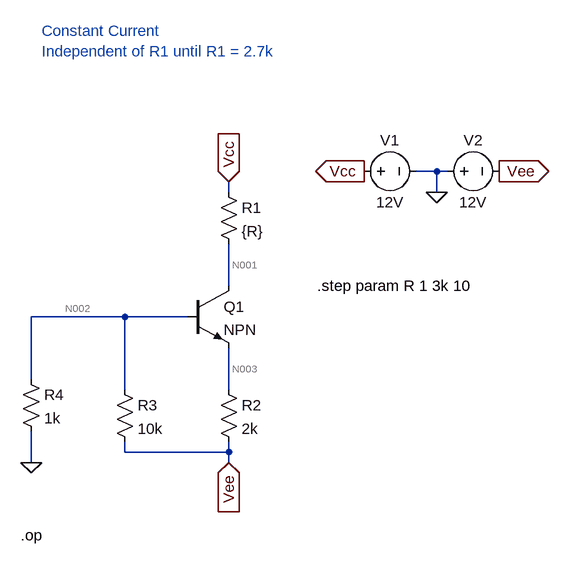
[diagram p0: schematic constant_current.asc]
constant_current.asc, the LTspice schematic file:
Version 4.1
SHEET 1 880 680
WIRE 608 -32 576 -32
WIRE 624 -32 608 -32
WIRE 288 0 288 -16
WIRE 608 0 608 -32
WIRE 288 144 288 80
WIRE 128 192 -16 192
WIRE 224 192 128 192
WIRE -16 288 -16 192
WIRE 128 304 128 192
WIRE 288 304 288 240
WIRE 128 400 128 384
WIRE 288 400 288 384
WIRE 288 400 128 400
WIRE -16 416 -16 368
WIRE 288 416 288 400
FLAG 608 0 0
FLAG 496 -32 Vcc
IOPIN 496 -32 Out
FLAG 704 -32 Vee
IOPIN 704 -32 Out
FLAG 288 -16 Vcc
IOPIN 288 -16 In
FLAG 288 416 Vee
IOPIN 288 416 In
FLAG -16 416 0
SYMBOL npn 224 144 R0
SYMATTR InstName Q1
SYMBOL voltage 480 -32 R270
WINDOW 0 32 56 VTop 2
WINDOW 3 -32 56 VBottom 2
WINDOW 123 0 0 Left 0
WINDOW 39 0 0 Left 0
SYMATTR InstName V1
SYMATTR Value 12V
SYMBOL res 272 -16 R0
SYMATTR InstName R1
SYMATTR Value {R}
SYMBOL res 272 288 R0
SYMATTR InstName R2
SYMATTR Value 2k
SYMBOL res 112 288 R0
SYMATTR InstName R3
SYMATTR Value 10k
SYMBOL res -32 272 R0
SYMATTR InstName R4
SYMATTR Value 1k
SYMBOL voltage 608 -32 R270
WINDOW 0 32 56 VTop 2
WINDOW 3 -32 56 VBottom 2
WINDOW 123 0 0 Left 0
WINDOW 39 0 0 Left 0
SYMATTR InstName V2
SYMATTR Value 12V
TEXT -32 528 Left 2 !.op
TEXT 424 144 Left 2 !.step param R 1 3k 10
TEXT 0 -248 Left 2 ;Constant Current \nIndependent of R1 until R1 = 2.7k

The netlist it stands for:
* constant_current.asc
Q1 N001 N002 N003 0 NPN
V1 Vcc 0 12V
R1 Vcc N001 {R}
R2 N003 Vee 2k
R3 N002 Vee 10k
R4 N002 0 1k
V2 0 Vee 12V
.model NPN NPN
.model PNP PNP
.lib standard.bjt
.op
.step param R 1 3k 10
* Constant Current
* Independent of R1 until R1 = 2.7k
.backanno
.end

* Results of the author's LTspice run, read from the files saved beside the schematic
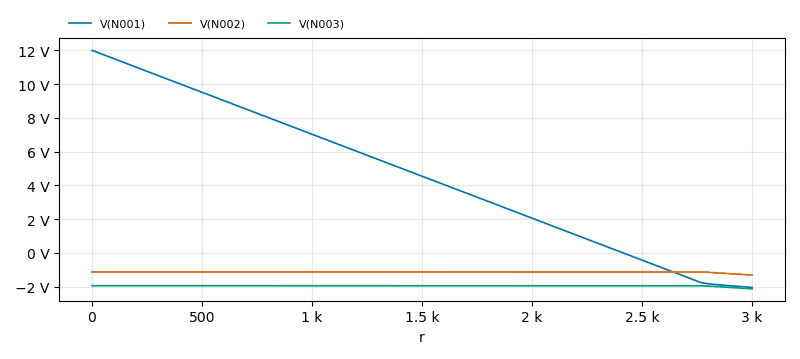
[diagram p1: Operating Point of constant_current.asc, plotted from the saved traces]
* Operating Point, 1 run:
*   V(N001): 12 V at r=1 , -2.05 V at r=3 k, min -2.05 V, max 12 V
*   V(N002): -1.136 V at r=1 , -1.318 V at r=3 k, min -1.318 V, max -1.136 V
*   V(N003): -1.952 V at r=1 , -2.134 V at r=3 k, min -2.134 V, max -1.952 V